# EAGLE design untitled (EAGLE 9.6.2)
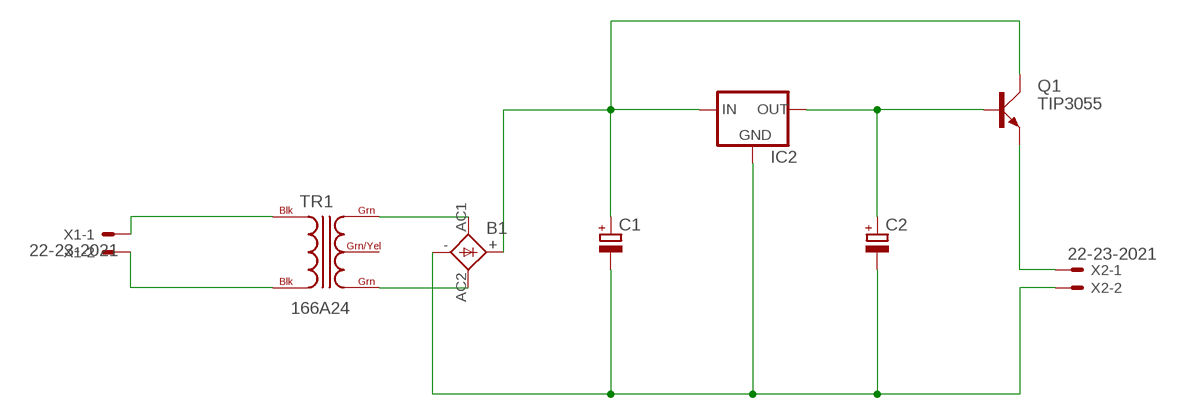
[diagram p0: schematic, sheet 1]

## Parts
B1  FB32  [FB32]
C1  CPOL-EUE7.5-16  [E7,5-16]
C2  CPOL-EUE3.5-8  [E3,5-8]
IC2  78XXL  [78XXL]
Q1  TIP3055  [TOP3AV]
TR1  166A24  [C2H]
X1  22-23-2021  [22-23-2021]
X2  22-23-2021  [22-23-2021]

## Nets
N$1: TR1.BLK@1(BLK) X1.1
N$2: TR1.BLK@2(BLK) X1.2
N$3: B1.AC1 TR1.GRN@1(GRN)
N$4: B1.AC2 TR1.GRN@2(GRN)
N$5: B1.+ C1.+ IC2.IN Q1.C
N$6: B1.- C1.- C2.- IC2.GND X2.2
N$7: Q1.E X2.1
N$8: C2.+ IC2.OUT Q1.B
Unconnected: TR1.GRN/YEL

## Library data of the parts
B1 = rectifier:FB32: FAGOR RECTIFIER grid 1 x 10,2 x 7,5 mm
C1 C2 = rcl:CPOL-EU: POLARIZED CAPACITOR, European symbol; SPICEPREFIX: C
IC2 = v-reg:78XXL: VOLTAGE REGULATOR
Q1 = transistor-power:TIP3055: NPN TRANSISTOR
TR1 = trafo-hammondmfg:166: OPEN STYLE FILAMENT & L.V. RECTIFIER USE TRANSFORMERS Economical single primnary 115VAC, 60 Hz or 117 VAC 50/60 Hz Source: Data sheet <http://www.hammondmfg.com/166.htm>
X1 X2 = con-molex:22-23-2021: .100" (2.54mm) Center Header - 2 Pin; MF: MOLEX; MPN: 22-23-2021; OC_FARNELL: 1462926; OC_NEWARK: 25C3832

## Board
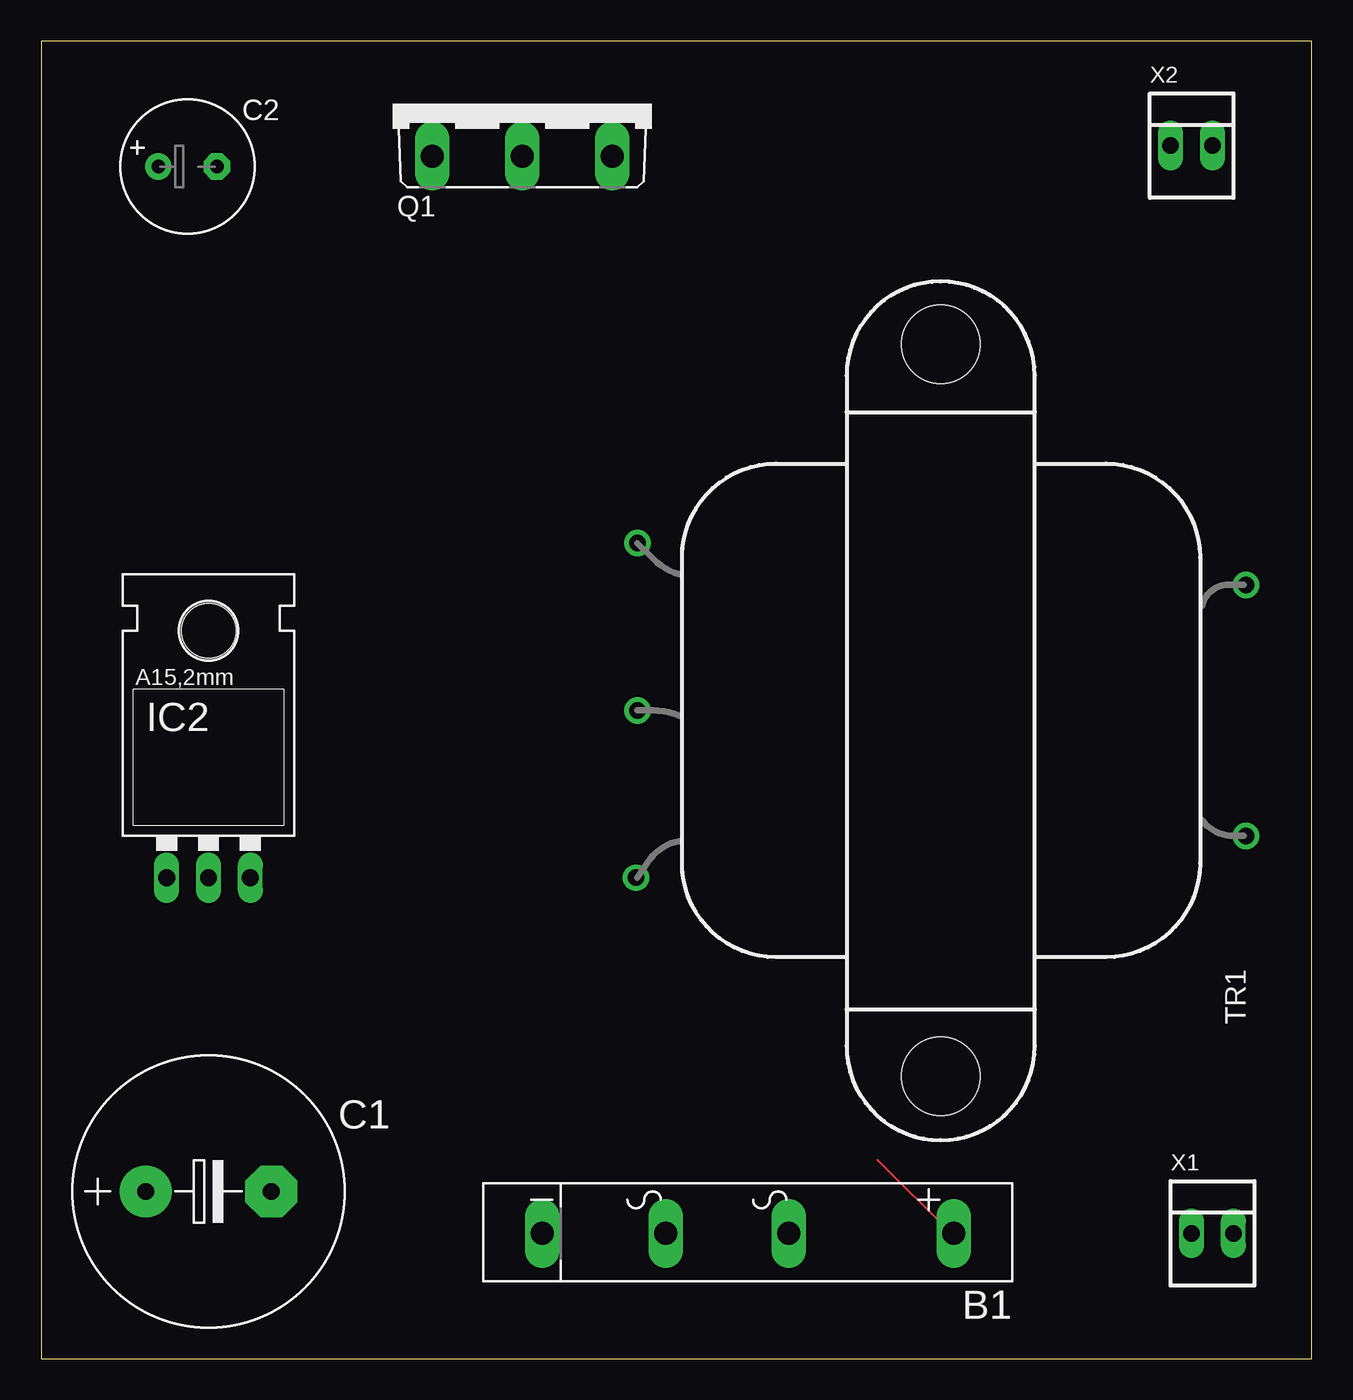
[diagram p1: board, top side]
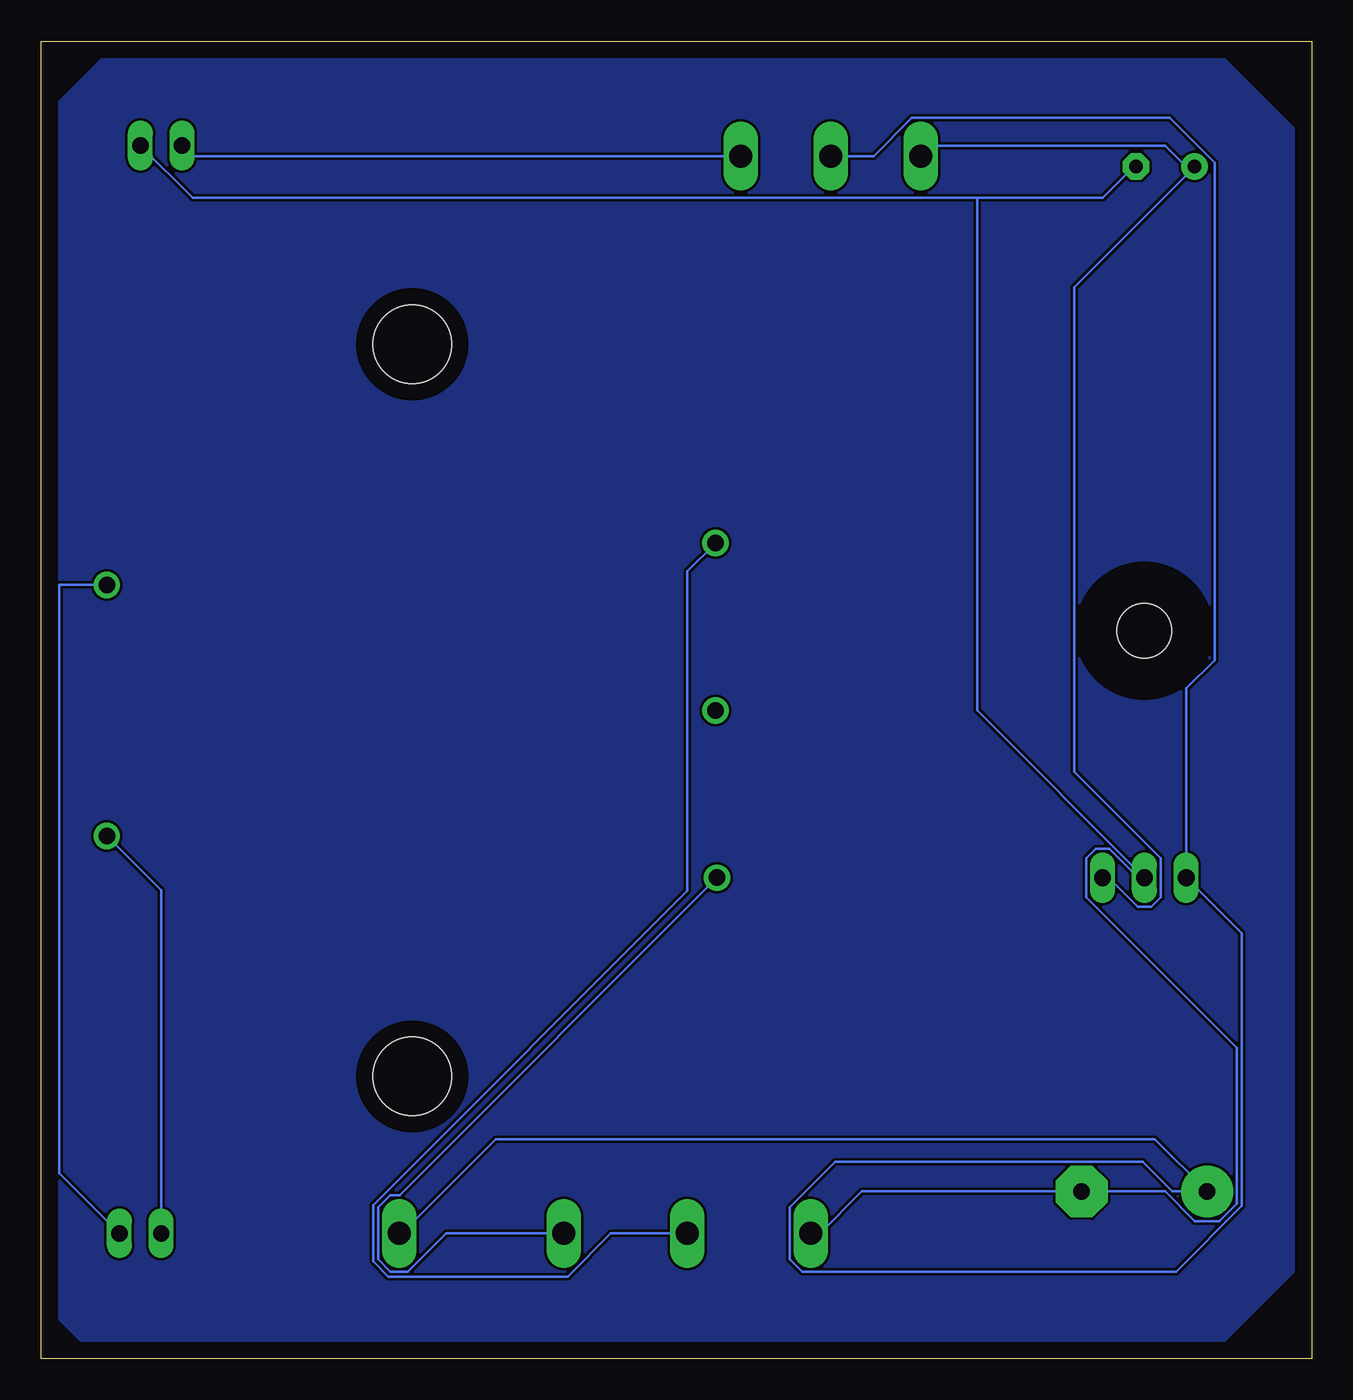
[diagram p2: board, bottom side, seen from below]

Size 77.14 x 80 mm. Coordinates in mm from the lower left corner, seen from the top.
Outline: 0,0 77.14,0 77.14,80 0,80 0,0
Copper layers (1*16): Top 0.035mm / dielectric 1.5mm / Bottom 0.035mm
Design rules "default": minimum track width 6mil, minimum drill 0.35mm, track to track 6mil, track to pad 6mil, pad to pad 6mil, via to via 6mil, smd to smd 6mil, copper to edge 40mil, drill to drill 6mil, minimum pad ring 10mil, minimum via ring 8mil, stop-mask expansion 4mil, vias tented up to drill 0mil, thermal gap 10mil

### Footprints (pad centres in the part's own frame; a part is rotated, then mirrored left to right if it is on the bottom)
FB32 = drill 1.397 long: + -13.5,0; - 11.494,0; AC1 -3.492,0; AC2 4.001,0
E7,5-16 = drill 1.016 pad 3.15: + -3.81,0 | drill 1.016 pad 3.15 octagon: - 3.81,0
E3,5-8 = drill 0.813 pad 1.6: + -1.778,0 | drill 0.813 pad 1.6 octagon: - 1.778,0
78XXL = drill 1.016 long: GND 0,-3.81; IN -2.54,-3.81; OUT 2.54,-3.81 | hole 3.302: 0,11.176
TOP3AV = drill 1.397 long: B -5.461,-3.175; C 0,-3.175; E 5.461,-3.175
C2H = drill 1 pad 1.6: BLK@1 -7.62,-18.545; BLK@2 7.62,-18.545; GRN/YEL 0,18.415; GRN@1 -10.16,18.495; GRN@2 10.16,18.415 | hole 4.75: 22.225,0; -22.225,0
22-23-2021 = drill 1 long: 1 -1.27,0; 2 1.27,0

### Placement (x,y rotation side)
B1  41.91,7.62 180 top
C1  10.16,10.16 0 top
C2  8.89,72.39 0 top
IC2  10.16,33.02 0 top
Q1  29.21,76.2 0 top
TR1  54.61,39.37 90 top
X1  71.12,7.62 0 top
X2  69.85,73.66 0 top

### Tracks (layer width: path | path; a pad name or v marks a point on that pad's centre or on a via)
N$1
  Top 0.152: 73.03,31.75 TR1.BLK@1
  Bottom 0.152: X1.1 69.85,28.45 TR1.BLK@1
N$2
  Bottom 0.152: X1.2 76.05,11.28 76.05,46.99 TR1.BLK@2
N$3
  Bottom 0.152: TR1.GRN@1 55.38,9.94 55.94,9.94 56.69,9.2 56.69,6.04 55.94,5.3 54.88,5.3 52.56,7.62 B1.AC1
N$4
  Bottom 0.152: TR1.GRN@2 37.91,47.82 37.91,28.4 56.99,9.32 56.99,5.92 56.06,4.99 45.18,4.99 42.55,7.62 B1.AC2
N$5
  Top 0.152: 50.8,12.06 55.25,7.62 B1.+
  Bottom 0.152: B1.+ 55.25,7.62 49.53,13.34 9.52,13.34 C1.+ 8.47,10.16 10.27,11.96 28.93,11.96 31.69,9.2 31.69,6.04 30.95,5.3 8.23,5.3 4.24,9.29 4.24,25.83 IC2.IN 7.62,40.7 5.89,42.43 5.89,72.63 8.62,75.35 24.28,75.35 26.6,73.03 Q1.C
N$6
  Bottom 0.152: B1.- 29.84,7.62 27.3,10.16 C1.- 8.9,10.16 7.1,8.36 5.6,8.36 4.55,9.41 4.55,18.89 13.69,28.04 13.69,30.38 13.11,30.96 12.29,30.96 10.54,29.21 IC2.GND 20.32,39.37 20.32,70.48 | X2.2 67.95,70.48 20.32,70.48 | 20.32,70.48 12.7,70.48 10.8,72.39 C2.-
N$7
  Bottom 0.152: X2.1 67.95,73.03 Q1.E
N$8
  Bottom 0.152: Q1.B 23.49,73.03 22.86,73.66 8.89,73.66 7.62,72.39 C2.+ 14.43,65.08 14.43,35.64 9.17,30.38 9.17,28.04 9.75,27.46 10.57,27.46 12.32,29.21 IC2.OUT
N$9
  pour Bottom: 6.35,80.01 72.39,80.01 77.47,74.93 77.47,3.81 73.66,0 6.35,0 0,6.35 0,73.66
N$10
  pour Bottom (isolate 1.27): 6.35,80.01 0,73.66 0,72.39 0,6.35 6.35,0 73.66,0 74.93,1.27 77.47,3.81 77.47,6.35 77.47,74.93 72.39,80.01